# Altium schematic sheet display.SchDoc
size A4
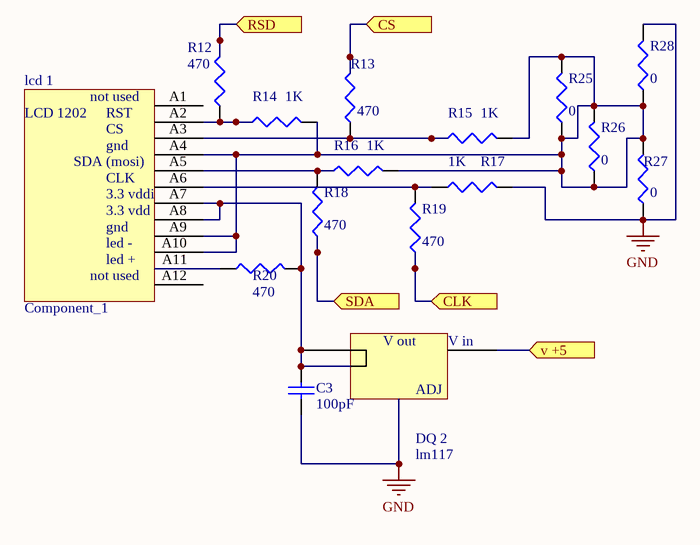
[diagram p0: display.SchDoc]

## Parts
C3  value 100pF  [C1206]  (hidden comment: Cap Semi)
DQ_2  lm117  [sot223_m]
lcd_1  Component_1  [LCD]
R12  value 470  [J1-0603]  (hidden comment: Res3)
R13  value 470  [J1-0603]  (hidden comment: Res3)
R14  value 1K  [J1-0603]  (hidden comment: Res3)
R15  value 1K  [J1-0603]  (hidden comment: Res3)
R16  value 1K  [J1-0603]  (hidden comment: Res3)
R17  value 1K  [J1-0603]  (hidden comment: Res3)
R18  value 470  [J1-0603]  (hidden comment: Res3)
R19  value 470  [J1-0603]  (hidden comment: Res3)
R20  value 470  [J1-0603]  (hidden comment: Res3)
R25  value 0  [J1-0603]  (hidden comment: Res3)
R26  value 0  [J1-0603]  (hidden comment: Res3)
R27  value 0  [J1-0603]  (hidden comment: Res3)
R28  value 0  [J1-0603]  (hidden comment: Res3)

## Ports
CLK (in), CS (in), RSD (in), SDA (in), v +5 (in)

## Nets
GND: C3.2 DQ_2.1 R17.2 R27.1 R28.2
CLK: R19.1 ; port CLK
CS: R13.2 ; port CS
RSD: R12.2 ; port RSD
SDA: R18.1 ; port SDA
v +5: DQ_2.3 ; port v +5
NetC3_1: C3.1 DQ_2.2 DQ_2.4 lcd_1.A7 lcd_1.A8 R20.2
Netlcd_1_A2: lcd_1.A2 R12.1 R14.1
Netlcd_1_A3: lcd_1.A3 R13.1 R15.1
Netlcd_1_A4: lcd_1.A4 lcd_1.A9 lcd_1.A10 R14.2 R15.2 R16.2 R25.1 R25.2 R26.1 R26.2 R27.2 R28.1
Netlcd_1_A5: lcd_1.A5 R16.1 R18.2
Netlcd_1_A6: lcd_1.A6 R17.1 R19.2
Netlcd_1_A11: lcd_1.A11 R20.1

Not connected (* = marked no-connect by the designer): lcd_1 A1 A12

## Notes on the sheet
- (in symbol Component_1) not used; LCD 1202; RST; CS; gnd; SDA (mosi); CLK; 3.3 vddi; 3.3 vdd; led -; led +
- (in symbol lm117) V out; V in; ADJ

## Library data of the parts
C3 = Cap Semi: Capacitor (Semiconductor SIM Model); Published: 8-Jun-2000; LatestRevisionDate: 29-May-2009; LatestRevisionNote: IPC-7351 Footprint Added.; PackageReference: C1206; Publisher: Altium Limited; PackageDescription: Chip Capacitor
R12-R20 R25-R28 = Res3: Resistor; Published: 8-Jun-2000; LatestRevisionDate: 29-May-2009; LatestRevisionNote: IPC-7351 Footprint Added.; PackageReference: J1-0603; Publisher: Altium Limited; PackageDescription: Chip Resistor
DQ_2 = lm117: Supplier 1: Digi-Key; Supplier Part Number 1: S602TSRPDKR-ND